# EasyEDA Pro project 电源转接板.eprj

# Schematic Schematic1
Create Date: 2024-07-25; Page Name: P1; Project Name: 电源转接板; Schematic Name: Schematic1; Update Date: 2024-07-25; Company: 嘉立创EDA; Page Size: A4; Version: V1.0
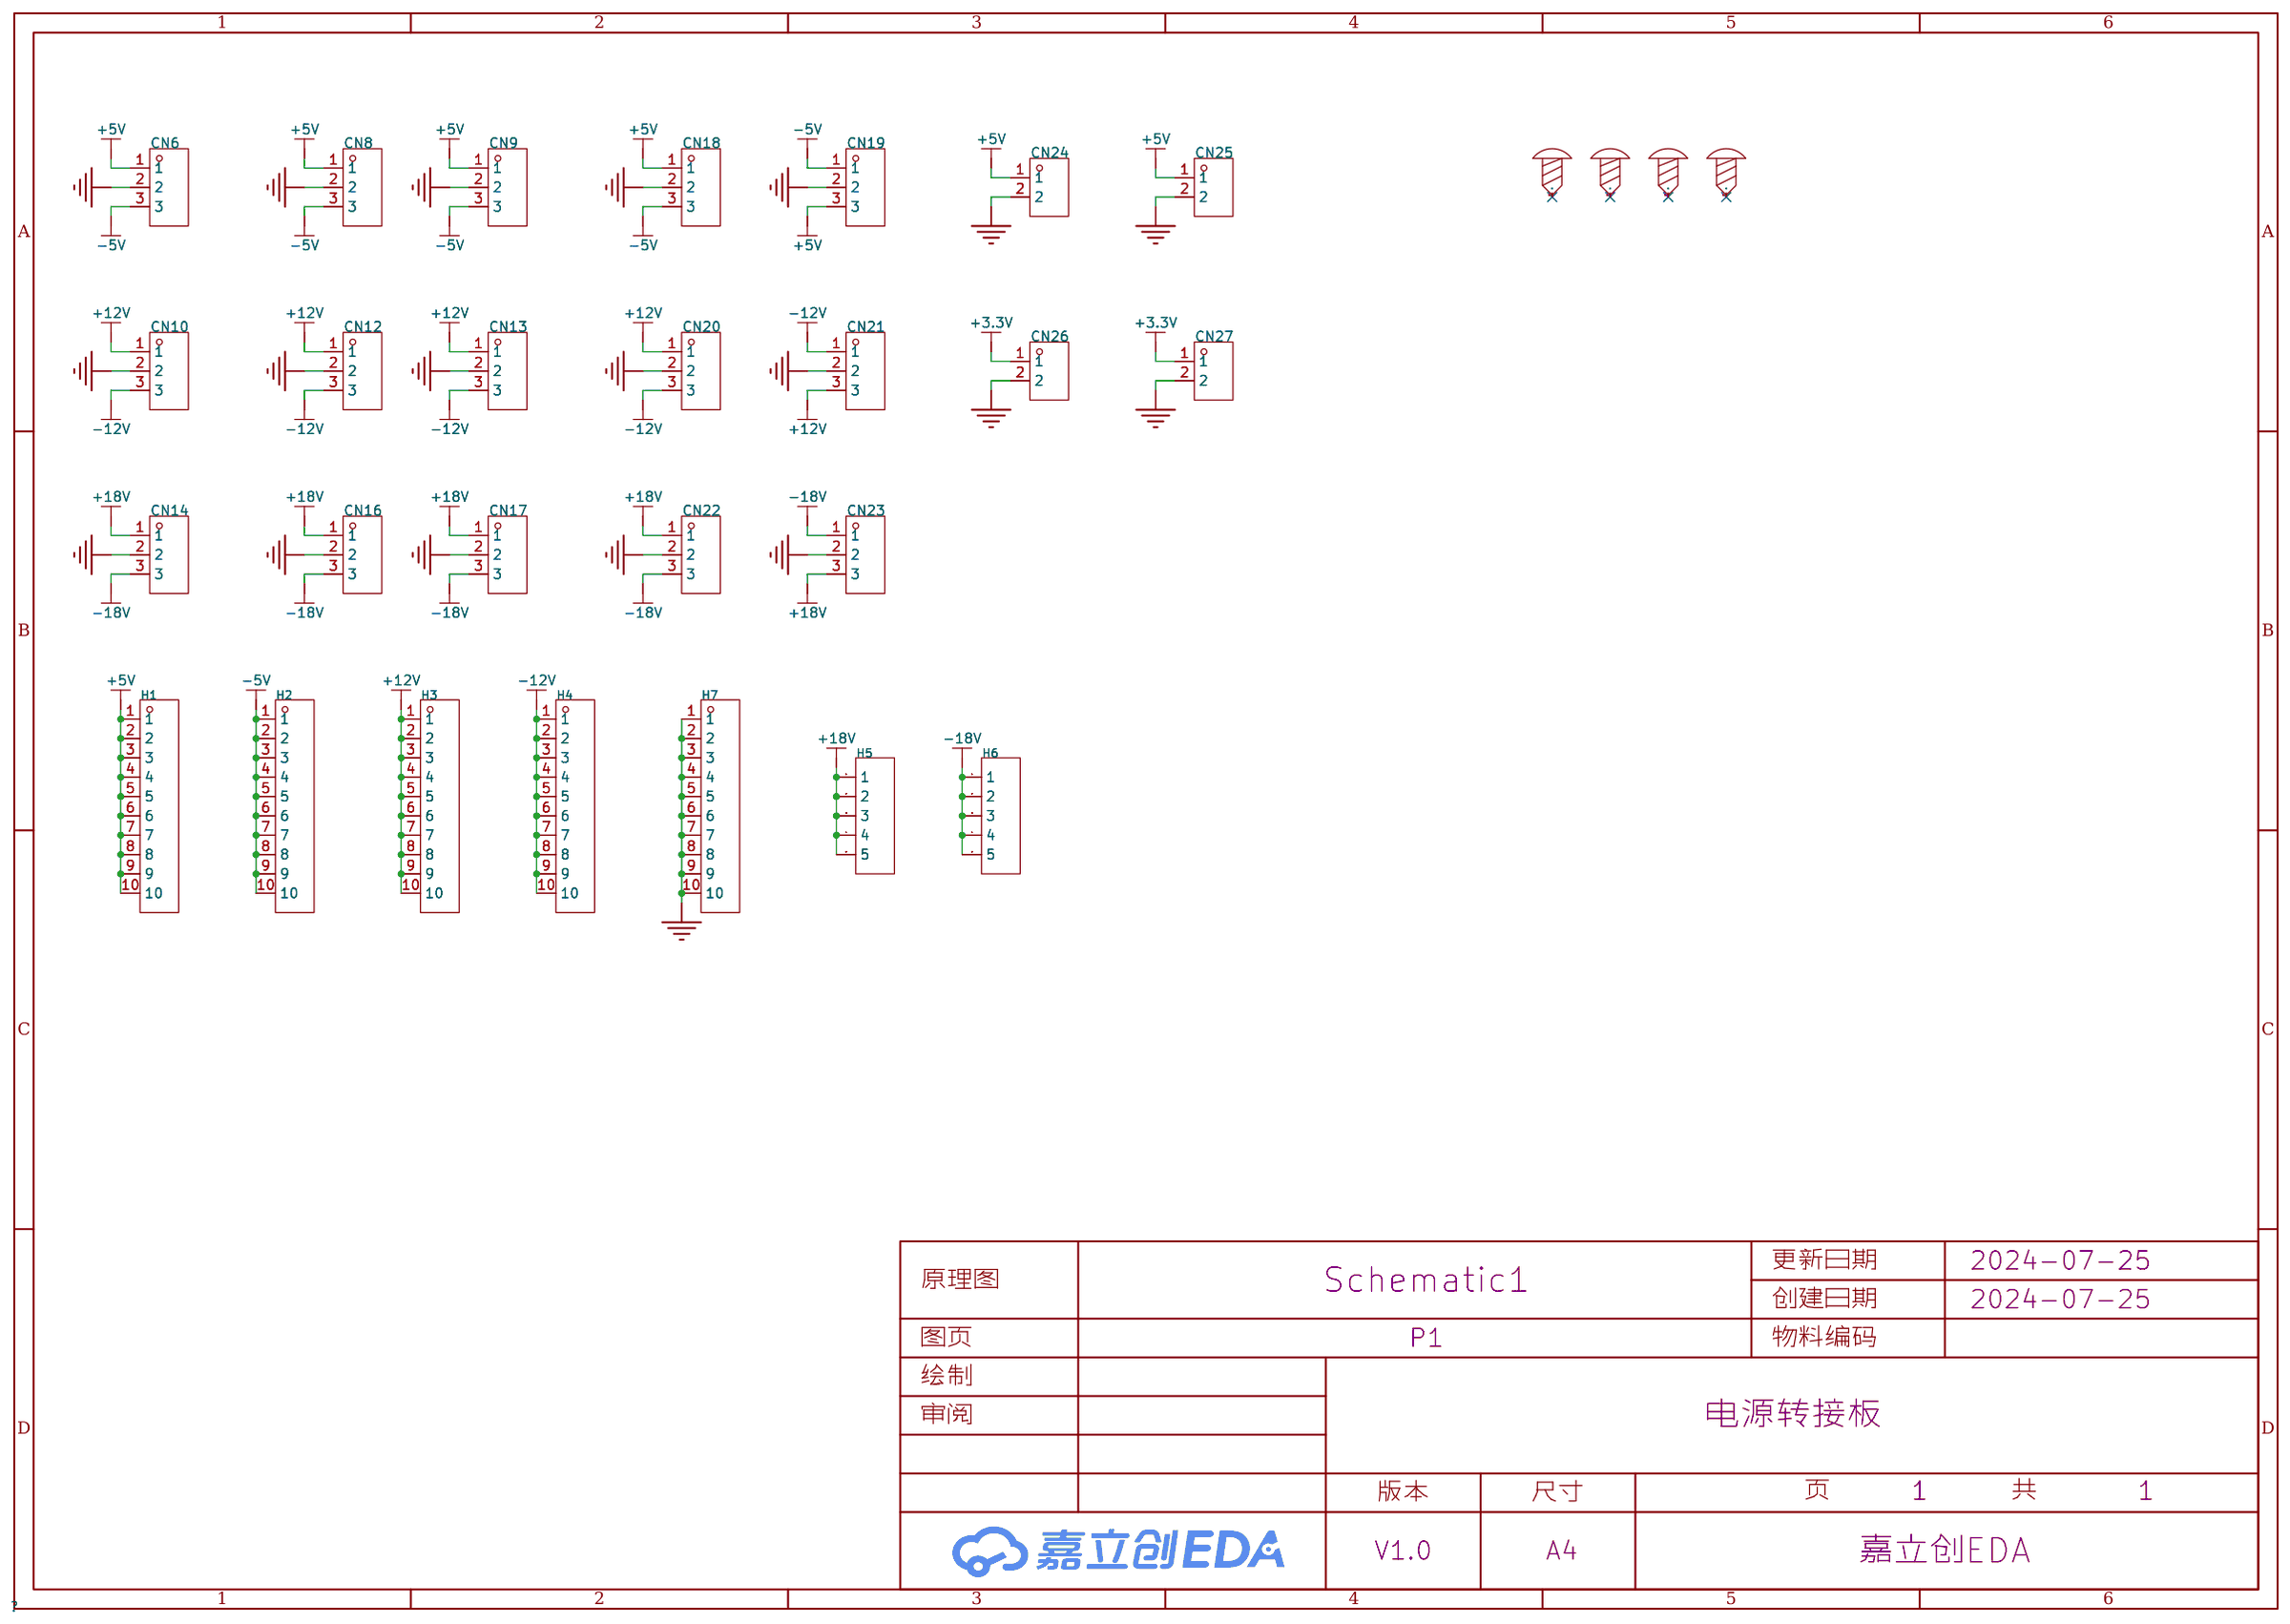
[diagram p0: schematic sheet]

## Parts
CN6  DB2EVC-3.81-3P-GN  [CONN-TH_3P-P5.08_DB2EVC-5.08-3P]
CN8  DB2EVC-3.81-3P-GN  [CONN-TH_3P-P5.08_DB2EVC-5.08-3P]
CN9  DB2EVC-3.81-3P-GN  [CONN-TH_3P-P5.08_DB2EVC-5.08-3P]
CN10  DB2EVC-3.81-3P-GN  [CONN-TH_3P-P5.08_DB2EVC-5.08-3P]
CN12  DB2EVC-3.81-3P-GN  [CONN-TH_3P-P5.08_DB2EVC-5.08-3P]
CN13  DB2EVC-3.81-3P-GN  [CONN-TH_3P-P5.08_DB2EVC-5.08-3P]
CN14  DB2EVC-3.81-3P-GN  [CONN-TH_3P-P5.08_DB2EVC-5.08-3P]
CN16  DB2EVC-3.81-3P-GN  [CONN-TH_3P-P5.08_DB2EVC-5.08-3P]
CN17  DB2EVC-3.81-3P-GN  [CONN-TH_3P-P5.08_DB2EVC-5.08-3P]
CN18  MX301-5.0-03P-BU01-Cu-Y-A  [CONN-TH_3P-P5.0-MX301-5.0-03P-BU01-CU-Y-A]
CN19  MX301-5.0-03P-BU01-Cu-Y-A  [CONN-TH_3P-P5.0-MX301-5.0-03P-BU01-CU-Y-A]
CN20  MX301-5.0-03P-BU01-Cu-Y-A  [CONN-TH_3P-P5.0-MX301-5.0-03P-BU01-CU-Y-A]
CN21  MX301-5.0-03P-BU01-Cu-Y-A  [CONN-TH_3P-P5.0-MX301-5.0-03P-BU01-CU-Y-A]
CN22  MX301-5.0-03P-BU01-Cu-Y-A  [CONN-TH_3P-P5.0-MX301-5.0-03P-BU01-CU-Y-A]
CN23  MX301-5.0-03P-BU01-Cu-Y-A  [CONN-TH_3P-P5.0-MX301-5.0-03P-BU01-CU-Y-A]
CN24  ZX-XH2.54-2PZZ  [CONN-TH_2P-P2.50_HX25003-2A]
CN25  ZX-XH2.54-2PZZ  [CONN-TH_2P-P2.50_HX25003-2A]
CN26  ZX-XH2.54-2PZZ  [CONN-TH_2P-P2.50_HX25003-2A]
CN27  ZX-XH2.54-2PZZ  [CONN-TH_2P-P2.50_HX25003-2A]
H1  -  [HDR-TH_10P-P2.54-V-F]
H2  -  [HDR-TH_10P-P2.54-V-F]
H3  -  [HDR-TH_10P-P2.54-V-F]
H4  -  [HDR-TH_10P-P2.54-V-F]
H5  -  [HDR-TH_5P-P2.54-V-F]
H6  -  [HDR-TH_5P-P2.54-V-F]
H7  -  [HDR-TH_10P-P2.54-V-F]
TP1  -  [M3螺丝]
TP2  -  [M3螺丝]
TP3  -  [M3螺丝]
TP4  -  [M3螺丝]

## Library data of the parts
CN6 CN8-CN10 CN12-CN14 CN16 CN17 = DB2EVC-3.81-3P-GN: 连接器类型:板端/插座-闭口;结构:1x3P;间距:3.81mm;颜色:绿色;安装方式:直针;排数:1;每排PIN数:3;额定电流:10A;额定电压:250V;工作温度范围:-40℃~+105℃;; LCSC Part Name: 3.81mm 1x3P 排数:1 每排P数:3; Supplier Part: C395692; Manufacturer: DORABO(地博电气); Supplier Footprint: 插件,P=3.81mm; JLCPCB Part Class: 扩展库; Datasheet: https://atta.szlcsc.com/upload/public/pdf/source/20230106/E295F87ABDAA44E449E4D4A582259339.pdf; Supplier: LCSC; Connector Type: 板端/插座-闭口; Structure: 1x3P; Pitch: 3.81mm; Color: 绿色; Mounting Style: 直针; Number of Pins: 3P; Number of Rows: 1; Number of PINs Per Row: 3; Current Rating (Max): 10A; Voltage Rating (Max): 250V; Operating Temperature Range: -40℃~+105℃
CN18-CN23 = MX301-5.0-03P-BU01-Cu-Y-A: 结构:1x3P;间距:5mm;颜色:蓝色;安装方式:直插;额定电流:16A;额定电压:300V;排数:1;线规 - AWG:14~24;线规 - 平方毫米:1.5;每排PIN数:3;触头材质:铜合金;触头镀层:锡;工作温度范围:-40℃~+105℃;; LCSC Part Name: 5mm 1x3P 排数:1 每排P数:3 直插; Supplier Part: C5188423; Manufacturer: MAX(迈旭); Supplier Footprint: 插件,P=5mm; JLCPCB Part Class: Extended Part; Datasheet: https://atta.szlcsc.com/upload/public/pdf/source/20230915/1F0A484E8C4B07E7C9BE20D191F8A304.pdf; Supplier: LCSC; Structure: 1x3P; Pitch: 5mm; Color: 蓝色; Mounting Style: 直插; Current Rating (Max): 16A; Voltage Rating (Max): 300V; Number of Pins: 3P; Number of Rows: 1; Wire Gauge - AWG: 14~24; Wire Gauge - mm2: 1.5; Number of PINs Per Row: 3; Contact Material: 铜合金; Contact Plating: 锡; Operating Temperature Range: -40℃~+105℃
CN24-CN27 = ZX-XH2.54-2PZZ: 插针结构:1x2P;间距:2.54mm;安装方式:直插;参考系列:XH;总PIN数:2P;排数:1;每排PIN数:2;行距:-;额定电流:3A;触头材质:黄铜;触头镀层:锡;工作温度范围:-25℃~+85℃;; Supplier Part: C7429632; Manufacturer: Megastar(兆星); Supplier Footprint: 插件,P=2.54mm; JLCPCB Part Class: 扩展库; Datasheet: https://atta.szlcsc.com/upload/public/pdf/source/20230619/19BA6947230AA44A04D3EDD65E618FD0.pdf; Supplier: LCSC; Pins Structure: 1x2P; Pitch: 2.54mm; Mounting Style: 直插; Reference Series: XH; Number of Pins: 2P; Number of Rows: 1; Number of PINs Per Row: 2; Current Rating (Max): 3A; Contact Material: 黄铜; Contact Plating: 锡; Operating Temperature Range: -25℃~+85℃
H1-H4 H7 = HDR-F_2.54_1x10P: Supplier Part: C2684744; Supplier Footprint: 插件
H5 H6 = HDR-F_2.54_1x5P: Supplier Part: C50950; Supplier Footprint: 插件
TP1-TP4 = M3螺丝: Supplier Footprint: 插件

## Nets
+3.3V: CN26.1 CN27.1
+5V: CN6.1 CN8.1 CN9.1 CN18.1 CN19.3 CN24.1 CN25.1 H1.1 H1.2 H1.3 H1.4 H1.5 H1.6 H1.7 H1.8 H1.9 H1.10
+12V: CN10.1 CN12.1 CN13.1 CN20.1 CN21.3 H3.1 H3.2 H3.3 H3.4 H3.5 H3.6 H3.7 H3.8 H3.9 H3.10
+18V: CN14.1 CN16.1 CN17.1 CN22.1 CN23.3 H5.1 H5.2 H5.3 H5.4 H5.5
-5V: CN6.3 CN8.3 CN9.3 CN18.3 CN19.1 H2.1 H2.2 H2.3 H2.4 H2.5 H2.6 H2.7 H2.8 H2.9 H2.10
-12V: CN10.3 CN12.3 CN13.3 CN20.3 CN21.1 H4.1 H4.2 H4.3 H4.4 H4.5 H4.6 H4.7 H4.8 H4.9 H4.10
-18V: CN14.3 CN16.3 CN17.3 CN22.3 CN23.1 H6.1 H6.2 H6.3 H6.4 H6.5
GND: CN6.2 CN8.2 CN9.2 CN10.2 CN12.2 CN13.2 CN14.2 CN16.2 CN17.2 CN18.2 CN19.2 CN20.2 CN21.2 CN22.2 CN23.2 CN24.2 CN25.2 CN26.2 CN27.2 H7.1 H7.2 H7.3 H7.4 H7.5 H7.6 H7.7 H7.8 H7.9 H7.10

Not connected (* = marked no-connect by the designer): TP1 1*; TP2 1*; TP3 1*; TP4 1*

# Board PCB1
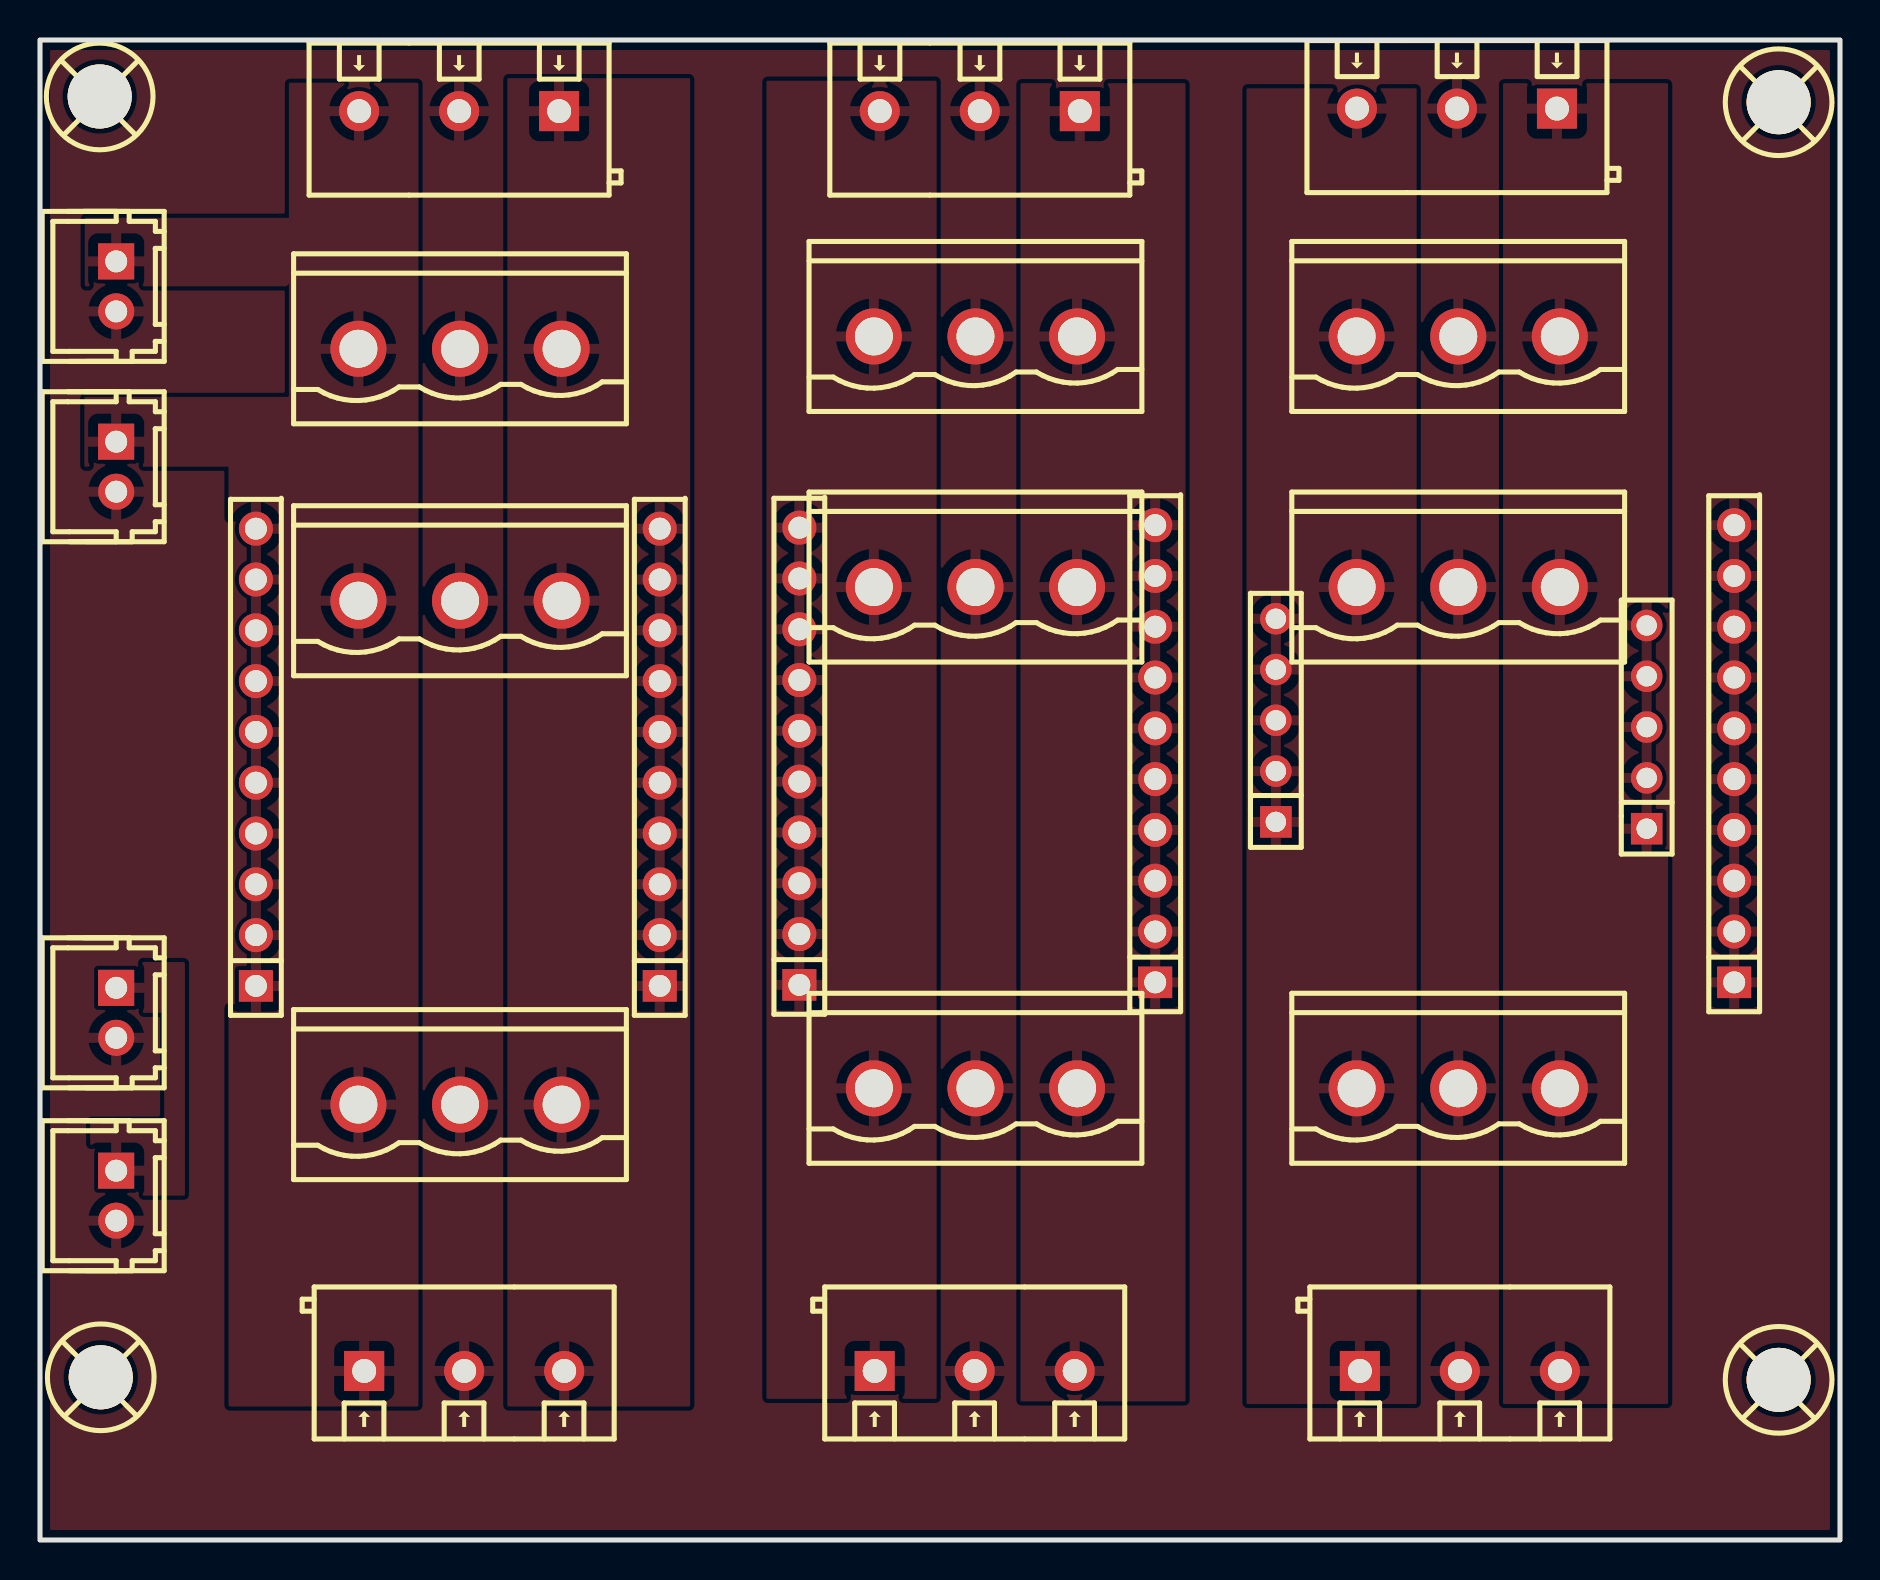
[diagram p1: board, top side]
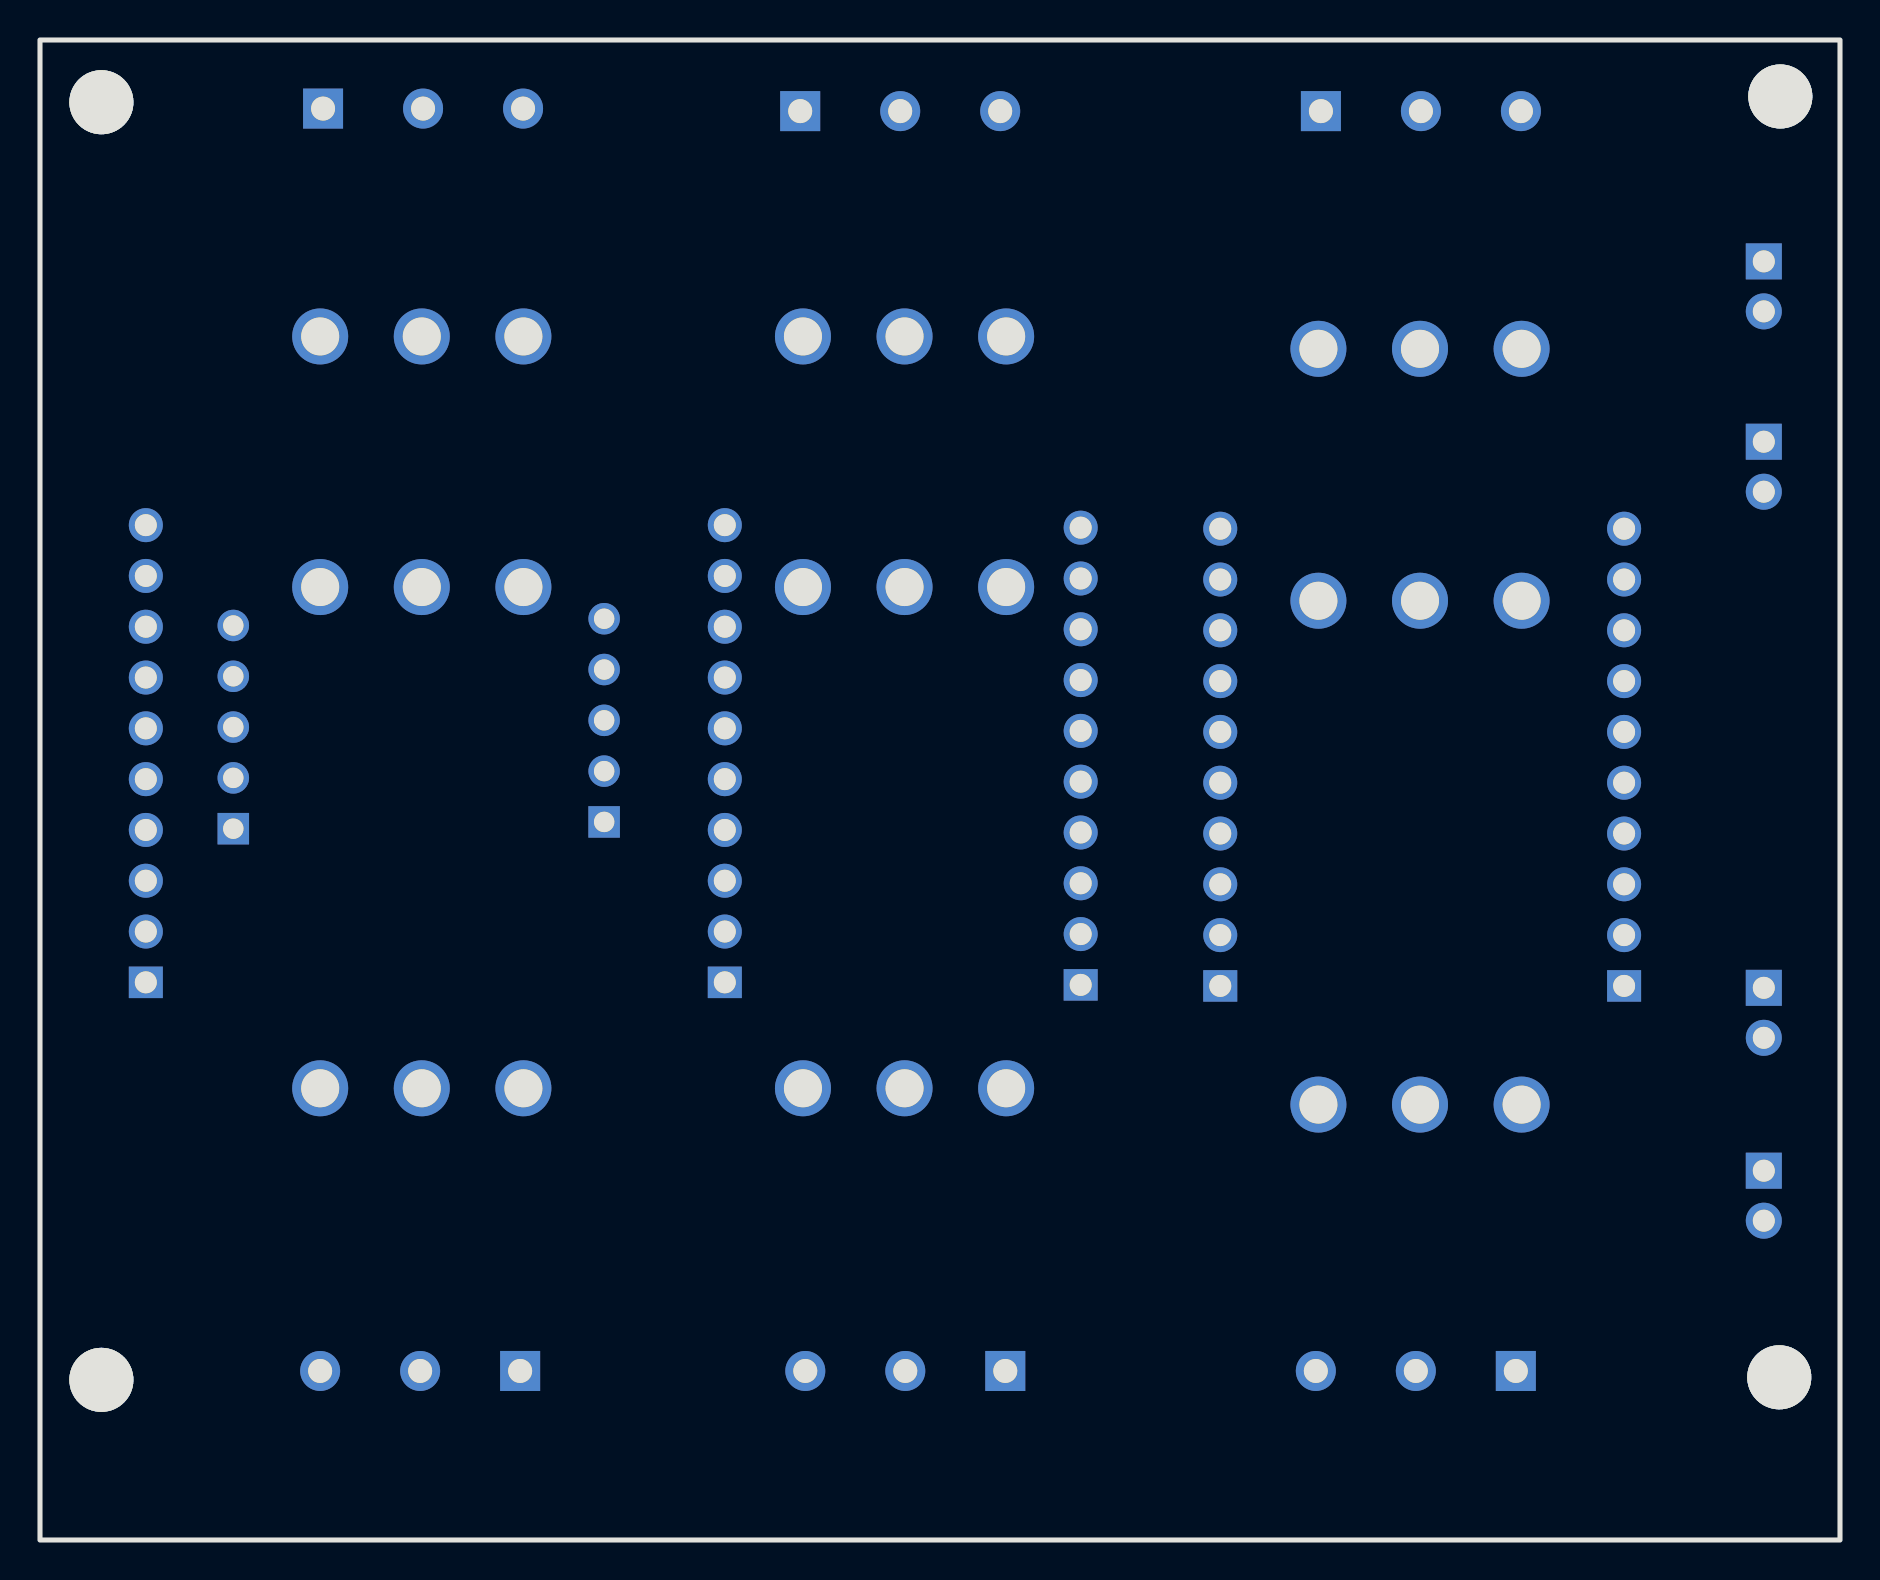
[diagram p2: board, bottom side, seen from below]

Outline 90 x 75 mm; copper layers: Top Layer, Bottom Layer. Coordinates in mm from the lower left corner of the outline.
Outline path: rectangle 0,75 90,0
Stack: Top Layer 0.035mm / Dielectric1 1.51mm FR4 er 4.5 / Bottom Layer 0.035mm

## Design rules (mm)
template: 自定义配置
spacing copperThickness1oz (default): track to track 0.102, other pairs 0.152 to 0.3
spacing copperThickness2oz: track to track 0.203, other pairs 0.152 to 0.3
track width copperThickness1oz (default): min 0.127, default 0.254, max 2.54
track width copperThickness2oz: min 0.203, default 0.254, max 2.54
differential pair differentialPair (default): width min 0.127, default 0.254, max 2.54; gap min 0.152, default 0.152
via viaSize (default): diameter min 0.5, default 0.61, max 10; hole min 0.3, default 0.305, max 6.3

## Placement (name value [footprint] x y rotation side)
CN6  DB2EVC-3.81-3P-GN  [CONN-TH_3P-P5.08_DB2EVC-5.08-3P]  21 21.77 0 top
CN8  DB2EVC-3.81-3P-GN  [CONN-TH_3P-P5.08_DB2EVC-5.08-3P]  21 46.96 0 top
CN9  DB2EVC-3.81-3P-GN  [CONN-TH_3P-P5.08_DB2EVC-5.08-3P]  21 59.56 0 top
CN10  DB2EVC-3.81-3P-GN  [CONN-TH_3P-P5.08_DB2EVC-5.08-3P]  46.77 22.59 0 top
CN12  DB2EVC-3.81-3P-GN  [CONN-TH_3P-P5.08_DB2EVC-5.08-3P]  46.77 47.65 0 top
CN13  DB2EVC-3.81-3P-GN  [CONN-TH_3P-P5.08_DB2EVC-5.08-3P]  46.77 60.18 0 top
CN14  DB2EVC-3.81-3P-GN  [CONN-TH_3P-P5.08_DB2EVC-5.08-3P]  70.91 22.59 0 top
CN16  DB2EVC-3.81-3P-GN  [CONN-TH_3P-P5.08_DB2EVC-5.08-3P]  70.91 47.65 0 top
CN17  DB2EVC-3.81-3P-GN  [CONN-TH_3P-P5.08_DB2EVC-5.08-3P]  70.91 60.18 0 top
CN18  MX301-5.0-03P-BU01-Cu-Y-A  [CONN-TH_3P-P5.0-MX301-5.0-03P-BU01-CU-Y-A]  21.21 8.45 0 top
CN19  MX301-5.0-03P-BU01-Cu-Y-A  [CONN-TH_3P-P5.0-MX301-5.0-03P-BU01-CU-Y-A]  20.95 71.44 180 top
CN20  MX301-5.0-03P-BU01-Cu-Y-A  [CONN-TH_3P-P5.0-MX301-5.0-03P-BU01-CU-Y-A]  46.74 8.45 0 top
CN21  MX301-5.0-03P-BU01-Cu-Y-A  [CONN-TH_3P-P5.0-MX301-5.0-03P-BU01-CU-Y-A]  46.99 71.44 180 top
CN22  MX301-5.0-03P-BU01-Cu-Y-A  [CONN-TH_3P-P5.0-MX301-5.0-03P-BU01-CU-Y-A]  70.99 8.45 0 top
CN23  MX301-5.0-03P-BU01-Cu-Y-A  [CONN-TH_3P-P5.0-MX301-5.0-03P-BU01-CU-Y-A]  70.85 71.57 180 top
CN24  ZX-XH2.54-2PZZ  [CONN-TH_2P-P2.50_HX25003-2A]  3.81 62.68 270 top
CN25  ZX-XH2.54-2PZZ  [CONN-TH_2P-P2.50_HX25003-2A]  3.81 53.66 270 top
CN26  ZX-XH2.54-2PZZ  [CONN-TH_2P-P2.50_HX25003-2A]  3.81 17.22 270 top
CN27  ZX-XH2.54-2PZZ  [CONN-TH_2P-P2.50_HX25003-2A]  3.81 26.36 270 top
H1  -  [HDR-TH_10P-P2.54-V-F]  10.8 39.13 90 top
H2  -  [HDR-TH_10P-P2.54-V-F]  30.99 39.13 90 top
H3  -  [HDR-TH_10P-P2.54-V-F]  37.97 39.19 90 top
H4  -  [HDR-TH_10P-P2.54-V-F]  55.76 39.31 90 top
H5  -  [HDR-TH_5P-P2.54-V-F]  61.79 40.98 90 top
H6  -  [HDR-TH_5P-P2.54-V-F]  80.34 40.65 90 top
H7  -  [HDR-TH_10P-P2.54-V-F]  84.71 39.31 90 top
TP1  -  [M3螺丝]  3.05 72.11 0 top
TP2  -  [M3螺丝]  3.1 8.07 0 top
TP3  -  [M3螺丝]  87 71.83 0 top
TP4  -  [M3螺丝]  87 7.94 0 top

## Footprints (pads in the part's own frame, mm; a bottom-side part is the same pattern mirrored in y, then rotated)
CONN-TH_2P-P2.50_HX25003-2A
  rect 1.8x1.8 hole 1.1: 1(-1.25,0)
  round 1.8 hole 1.1: 2(1.25,0)
CONN-TH_3P-P5.0-MX301-5.0-03P-BU01-CU-Y-A
  rect 2x2 hole 1.2: 1(-5,0)
  round 2 hole 1.2: 2(0,0) 3(5,0)
CONN-TH_3P-P5.08_DB2EVC-5.08-3P
  round 2.8 hole 1.9: 1(-5.08,0) 2(0,0) 3(5.08,0)
HDR-TH_5P-P2.54-V-F
  rect 1.575x1.575 hole 1.02: 1(-5.08,0)
  round 1.575 hole 1.02: 2(-2.54,0) 3(0,0) 4(2.54,0) 5(5.08,0)
HDR-TH_10P-P2.54-V-F
  rect 1.575x1.7 hole 1.1: 1(-11.43,0)
  round 1.7 hole 1.1: 2(-8.89,0) 3(-6.35,0) 4(-3.81,0) 5(-1.27,0) 6(1.27,0) 7(3.81,0) 8(6.35,0) 9(8.89,0) 10(11.43,0)
M3螺丝
  round 3.2 hole 3.2: 1(-0.064,0.064)

## Nets
As in the schematic.

Pads without a net: TP1 1; TP2 1; TP3 1; TP4 1

## Copper pours and planes (outline as drawn; the poured copper is in the pictures)
+3.3V on Top Layer: 2.29,28.9 2.29,26.36 6.21,26.36 6.21,21.14 6.04,20.97 2.51,20.97 2.51,17.22 7.25,17.22 7.25,28.9
+5V on Top Layer: 12.45,72.86 12.45,66.11 2.24,66.11 2.24,62.68 12.32,62.68 12.45,62.81 12.45,57.21 12.4,57.16 2.22,57.16 2.22,53.72 2.16,53.66 9.42,53.66 9.42,6.67 18.92,6.67 18.92,72.86
+12V on Top Layer: 36.32,72.97 44.83,72.97 44.83,7.06 36.32,7.06
+18V on Top Layer: 60.32,72.59 68.83,72.59 68.83,6.8 60.32,6.8
-5V on Top Layer: 23.37,73.09 32.51,73.09 32.51,6.67 23.37,6.67
-12V on Top Layer: 49.02,72.84 57.28,72.84 57.28,6.93 49.02,6.93
-18V on Top Layer: 73.15,72.84 81.41,72.84 81.41,6.8 73.15,6.8
GND on Top Layer: 0,75 90,75 90,0.05 0,0.05
